# Altium project PCB_Project.PrjPcb
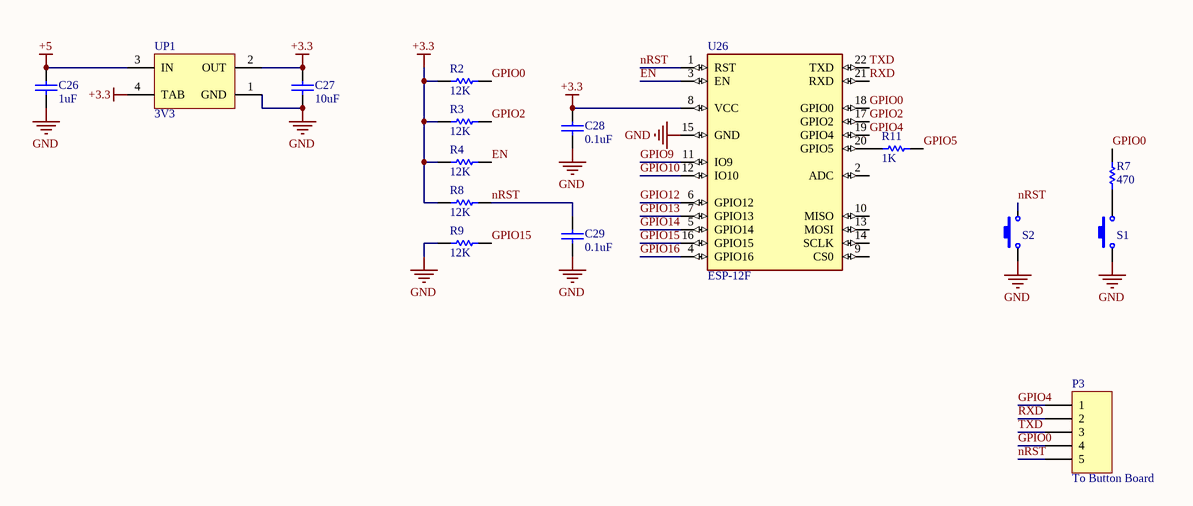
[diagram p0: Button.SchDoc]
3 sheets, 99 parts. Net scope: global (net labels, ports and power ports of the same name join across sheets).
Board files: Bottom.PcbDoc, Top.PcbDoc, LEDs.PcbDoc
Sheets:
  Button.SchDoc
  Top.SchDoc
  LEDs.SchDoc

## Sheet Button.SchDoc
size A; SheetNumber: 2; SheetTotal: 3

### Parts
C26  1uF  [CAPC3413X12N]
C27  10uF  [CAPC3413X12N]
C28  0.1uF  [CAPC3413X12N]
C29  0.1uF  [CAPC3413X12N]
P3  To Button Board  [HDR1X5]
R2  12K  [RES0805]
R3  12K  [RES0805]
R4  12K  [RES0805]
R7  470  [RES0805]
R8  12K  [RES0805]
R9  12K  [RES0805]
R11  1K  [RES0805]
S1  Switch PB  [SW-PB]  (value not drawn)
S2  Switch PB  [SW-PB]  (value not drawn)
U26  ESP-12F  [ESP-12F]
UP1  3V3  [SOT223]

### Nets
+3.3: C27.1 C28.1 R2.1 R3.1 R4.1 R8.1 U26.8(VCC) UP1.2(OUT) UP1.4(TAB)
+5: C26.1 UP1.3(IN)
GND: C26.2 C27.2 C28.2 C29.1 R9.1 S1.1 S2.1 U26.15(GND) UP1.1(GND)
EN: R4.2 U26.3(EN)
GPIO0: P3.4 R2.2 R7.1 U26.18(GPIO0)
GPIO2: R3.2 U26.17(GPIO2)
GPIO4: P3.1 U26.19(GPIO4)
GPIO5: R11.2
GPIO9: U26.11(IO9)
GPIO10: U26.12(IO10)
GPIO12: U26.6(GPIO12)
GPIO13: U26.7(GPIO13)
GPIO14: U26.5(GPIO14)
GPIO15: R9.2 U26.16(GPIO15)
GPIO16: U26.4(GPIO16)
nRST: C29.2 P3.5 R8.2 S2.2 U26.1(RST)
RXD: P3.2 U26.21(RXD)
TXD: P3.3 U26.22(TXD)
NetR7_2: R7.2 S1.2
NetR11_1: R11.1 U26.20(GPIO5)

Not connected (* = marked no-connect by the designer): U26 2(ADC) 9(CS0) 10(MISO) 13(MOSI) 14(SCLK)

### Library data of the parts
C26-C29 = CAP SMD 0805: CAP 0805; Designer: Abbas Basereh; Desc.: CAP SMD 0805; Data: 16-12-2016
P3 = Header 5: Header, 5-Pin; LatestRevisionDate: 17-Jul-2002; LatestRevisionNote: Re-released for DXP Platform.; Publisher: Altium Limited
R2-R4 R7-R9 R11 = RES SMD PACKAGE: TOTAL SMD RESISTOR PACK; Designer: Abbas Basereh; Desc.: RES SMD PAKAGES; Data: 2017-3-10
S1 S2 = Switch PB: Push Button Switch
U26 = ESP-12F: WiFi Module; MF: AI-Thinker; Price: None; SnapEDA_Link: https://www.snapeda.com/parts/ESP-12F/AI-Thinker/view-part/6648243/?ref=snap; Check_prices: https://www.snapeda.com/parts/ESP-12F/AI-Thinker/view-part/6648243/?ref=eda; Availability: No availability data; Value: *; MP: ESP-12F; Package: Package
UP1 = AMS1117-x.x: x.x Volt, 800mA Low-Dropout Linear Regulator, 4-pin SOT-223; Designer: Ali Hafizi; Data: 16-12-2016

## Sheet Top.SchDoc
size A; SheetNumber: 3; SheetTotal: 2
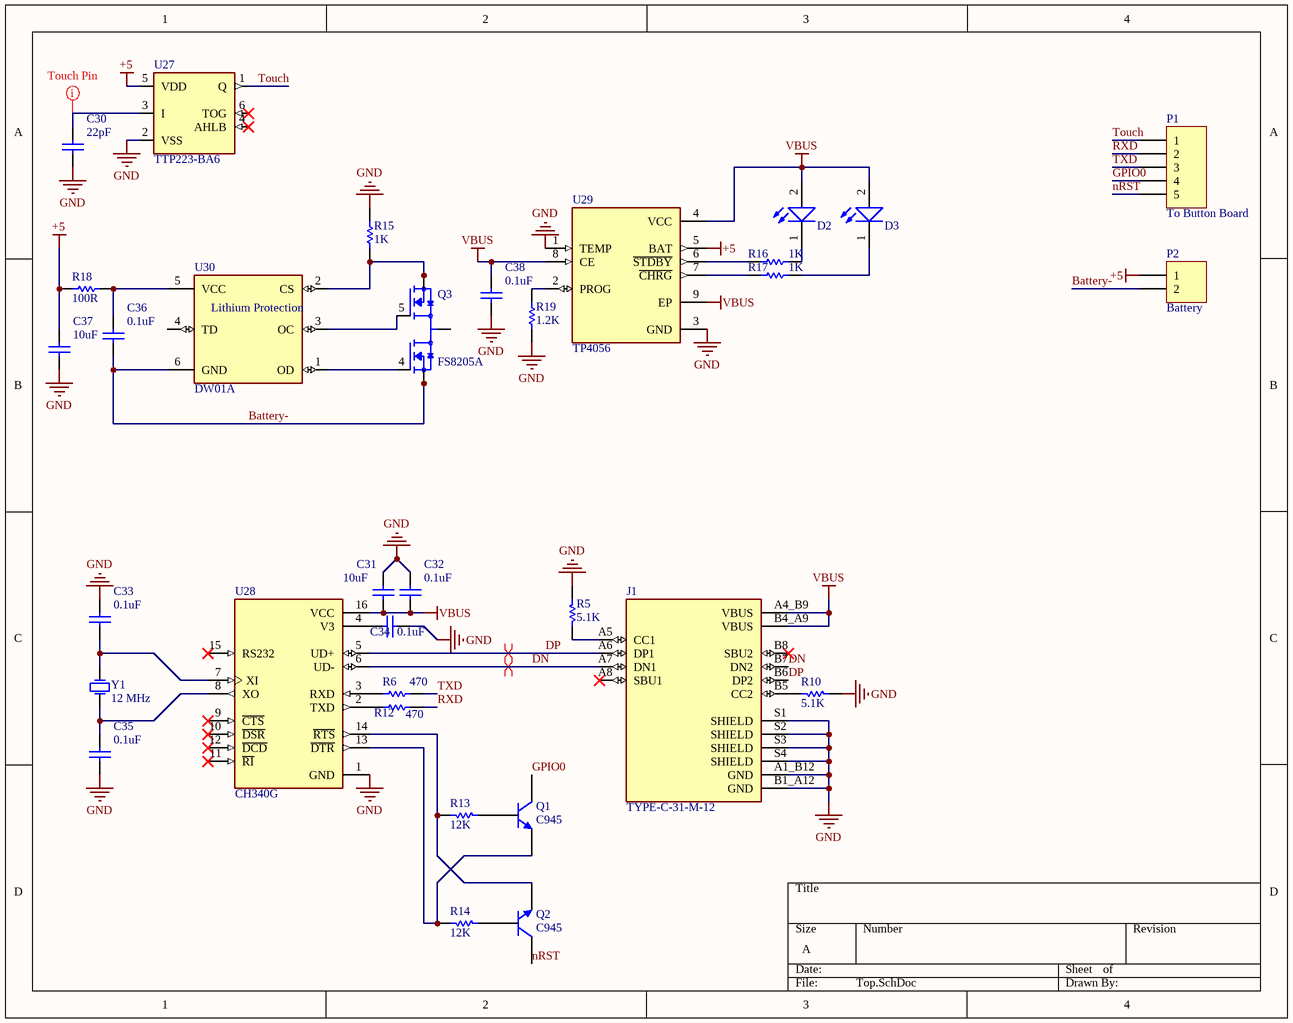
[diagram p1: Top.SchDoc]

### Parts
C30  22pF  [CAPC3413X12N]
C31  10uF  [CAPC3413X12N]
C32  0.1uF  [CAPC3413X12N]
C33  0.1uF  [CAPC3413X12N]
C34  0.1uF  [CAPC3413X12N]
C35  0.1uF  [CAPC3413X12N]
C36  0.1uF  [CAPC3413X12N]
C37  10uF  [CAPC3413X12N]
C38  0.1uF  [CAPC3413X12N]
D2  LED SMD PACKAGE  [LED_SMD_0805]  (value not drawn)
D3  LED SMD PACKAGE  [LED_SMD_0805]  (value not drawn)
J1  TYPE-C-31-M-12  [HRO_TYPE-C-31-M-12]
P1  To Button Board  [HDR1X5]
P2  Battery  [HDR1X2]
Q1  C945  [SOT23_N]
Q2  C945  [SOT23_N]
Q3  FS8205A  [SOP65P640X120-8N]
R5  5.1K  [RES0805]
R6  470  [RES0805]
R10  5.1K  [RES0805]
R12  470  [RES0805]
R13  12K  [RES0805]
R14  12K  [RES0805]
R15  1K  [RESC3413X04N]
R16  1K  [RESC3413X04N]
R17  1K  [RESC3413X04N]
R18  100R  [RESC3413X04N]
R19  1.2K  [RESC3413X04N]
U27  TTP223-BA6  [SOT23-6]
U28  CH340G  [SOIC127P600X180-16N]
U29  TP4056  [SOP127P600X175-9N]
U30  DW01A  [SOT23-6]
Y1  12 MHz  [Crystal SMD]

### Nets
+5: C37.1 P2.1 R18.1 U27.5(VDD) U29.5(BAT)
GND: C30.2 C31.1 C32.1 C33.1 C34.1 C35.2 C37.2 C38.2 J1.A1_B12(GND) J1.B1_A12(GND) J1.S1(SHIELD) J1.S2(SHIELD) J1.S3(SHIELD) J1.S4(SHIELD) R5.1 R10.1 R15.1 R19.1 U27.2(VSS) U28.1(GND) U29.1(TEMP) U29.3(GND)
VBUS: C31.2 C32.2 C38.1 D2.2(A) D3.2(A) J1.A4_B9(VBUS) J1.B4_A9(VBUS) U28.16(VCC) U29.4(VCC) U29.8(CE) U29.9(EP)
Battery-: C36.2 P2.2 Q3.2(S1) Q3.3(S1) U30.6(GND)
DN: J1.A7(DN1) J1.B7(DN2) U28.6(UD-)
DP: J1.A6(DP1) J1.B6(DP2) U28.5(UD+)
GPIO0: P1.4 Q1.3(C)
nRST: P1.5 Q2.3(C)
RXD: P1.2 R12.2
Touch: P1.1 U27.1(Q)
TXD: P1.3 R6.2
NetC30_1: C30.1 U27.3(I)
NetC33_2: C33.2 U28.7(XI) Y1.2(OSC2)
NetC34_2: C34.2 U28.4(V3)
NetC35_1: C35.1 U28.8(XO) Y1.1(OSC1)
NetC36_1: C36.1 R18.2 U30.5(VCC)
NetD2_1: D2.1(K) R16.2
NetD3_1: D3.1(K) R17.2
NetJ1_A5: J1.A5(CC1) R5.2
NetJ1_B5: J1.B5(CC2) R10.2
NetQ1_1: Q1.1(B) R13.2
NetQ1_2: Q1.2(E) R14.1 U28.13(~{DTR})
NetQ2_1: Q2.1(B) R14.2
NetQ2_2: Q2.2(E) R13.1 U28.14(~{RTS})
NetQ3_1: Q3.1(D12) Q3.8(D12)
NetQ3_4: Q3.4(G1) U30.1(OD)
NetQ3_5: Q3.5(G2) U30.3(OC)
NetQ3_6: Q3.6(S2) Q3.7(S2) R15.2 U30.2(CS)
NetR6_1: R6.1 U28.3(RXD)
NetR12_1: R12.1 U28.2(TXD)
NetR16_1: R16.1 U29.6(~{STDBY})
NetR17_1: R17.1 U29.7(~{CHRG})
NetR19_2: R19.2 U29.2(PROG)

Not connected (* = marked no-connect by the designer): J1 A8(SBU1)* B8(SBU2)*; U27 4(AHLB)* 6(TOG)*; U28 9(~{CTS})* 10(~{DSR})* 11(~{RI})* 12(~{DCD})* 15(RS232)*; U30 4(TD)

### Layout directives
differential pair: DN, DP
mark named Touch Pin: NetC30_1

### Notes on the sheet
- (in symbol DW01A) Lithium Protection

### Library data of the parts
C30-C38 = CAP SMD 0805: CAP 0805; Designer: Abbas Basereh; Desc.: CAP SMD 0805; Data: 16-12-2016
D2 D3 = LED SMD PACKAGE: SMD Mono-color Chip LED Waterclear; Part Number: 150080BS75000; Peak Wavelength: 465 nm; Forward Voltage: 3.2 V; Published Date: Jan 2017; Publisher: Ali Hafizi
J1 = TYPE-C-31-M-12: USB Connectors 24 Receptacle 1 8.94*7.3mm RoHS; MF: HRO Electronics Co., Ltd.; Price: None; Value: *; SnapEDA_Link: https://www.snapeda.com/parts/TYPE-C-31-M-12/HRO+Electronics+Co.%252C+Ltd./view-part/?ref=snap; Package: Package; Availability: Not in stock; Check_prices: https://www.snapeda.com/parts/TYPE-C-31-M-12/HRO+Electronics+Co.%252C+Ltd./view-part/?ref=eda; MP: TYPE-C-31-M-12
P1 = Header 5: Header, 5-Pin; LatestRevisionDate: 17-Jul-2002; LatestRevisionNote: Re-released for DXP Platform.; Publisher: Altium Limited
P2 = Header 2: Header, 2-Pin; LatestRevisionDate: 17-Jul-2002; LatestRevisionNote: Re-released for DXP Platform.; Publisher: Altium Limited
Q1 Q2 = C945: NPN Silicon Epitaxial Planar Transistor; Published: 2017-2-8; LatestRevisionDate: 2017; LatestRevisionNote: IPC-7351 Footprint Added.; DatasheetVersion: 2017; PackageVersion: 2017-2-8; PackageReference: SOT23; Publisher: Abbas Basereh; PackageDescription: 3-Pin SOT-23 Package 0.95 mm Pitch, 2.3 mm Lead Span; ComponentLink1Description: Manufacturer Link; ComponentLink1URL: http://www.taitroncomponents.com/; ComponentLink2Description: Datasheet; ComponentLink2URL: http://www.taitroncomponents.com/
Q3 = FS8205A: N/A; MF: Fortune Semiconductor; MP: FS8205A; Value: *; Availability: Not in stock; Package: Package; Price: None; SnapEDA_Link: https://www.snapeda.com/parts/FS8205A/Fortune+Semiconductor/view-part/?ref=snap; Check_prices: https://www.snapeda.com/parts/FS8205A/Fortune+Semiconductor/view-part/?ref=eda
R5 R6 R10 R12-R14 = RES SMD PACKAGE: as R2 on sheet Button; Data: 2017-3-10
R15-R19 = RES 0805 0.125W: RES 0805; Designer: Abbas Basereh; Desc.: RES SMD 0805; Data: 16-12-2016
U27 = TTP223-BA6: <b>DÃ©tecteur</b> de Touches Tactiles IC<p> Doc constructeur <a href="http://geii/magasin/pdf/TTP223-BA6.pdf" title="Enlarge picture"> <img src="http://geii/magasin/images/pdf.jpg"></a><p> <b>GEII/IUT ANGERS</b>; MF: tontek; Value: *; SnapEDA_Link: https://www.snapeda.com/parts/TTP223-BA6/TONTEK/view-part/?ref=snap; Price: None; Availability: Not in stock; Package: None; MP: TTP223-BA6; Check_prices: https://www.snapeda.com/parts/TTP223-BA6/TONTEK/view-part/?ref=eda
U28 = CH340G: USB Interface Integrated Circuit; MF: WCH; Value: *; SnapEDA_Link: https://www.snapeda.com/parts/Ch340G/WCH/view-part/?ref=snap; MP: Ch340G; Check_prices: https://www.snapeda.com/parts/Ch340G/WCH/view-part/?ref=eda; Availability: Not in stock; Price: None; Package: None
U29 = TP4056: Complete single cell Li-Ion battery with a constant current / constant voltage linear charger; MF: NanJing Top Power ASIC Corp.; Check_prices: https://www.snapeda.com/parts/TP4056/NanJing+Top+Power+ASIC+Corp./view-part/?ref=eda; SnapEDA_Link: https://www.snapeda.com/parts/TP4056/NanJing+Top+Power+ASIC+Corp./view-part/?ref=snap; Price: None; Availability: Not in stock; Package: Package; MP: TP4056; Value: *
U30 = DW01A: One Cell Lithium-ion/Polymer Battery Protection IC; MF: Fortune Semiconductor; SnapEDA_Link: https://www.snapeda.com/parts/DW01A/Fortune+Semiconductor/view-part/?ref=snap; Package: SOT-23-6 Fortune Semiconductor; Value: *; MP: DW01A; Check_prices: https://www.snapeda.com/parts/DW01A/Fortune+Semiconductor/view-part/?ref=eda
Y1 = XTAL: XTAL Crystal; Designer: ABBAS BASEREH; Design Date: 2017-1-3; ComponentLink1Description: Datasheet; ComponentLink2Description: Reference; Mounting Technology: Surface Mount\Through-Hole; Value: 12 MHz; Status: Unreleased

## Sheet LEDs.SchDoc
size A; SheetNumber: 1; SheetTotal: 4
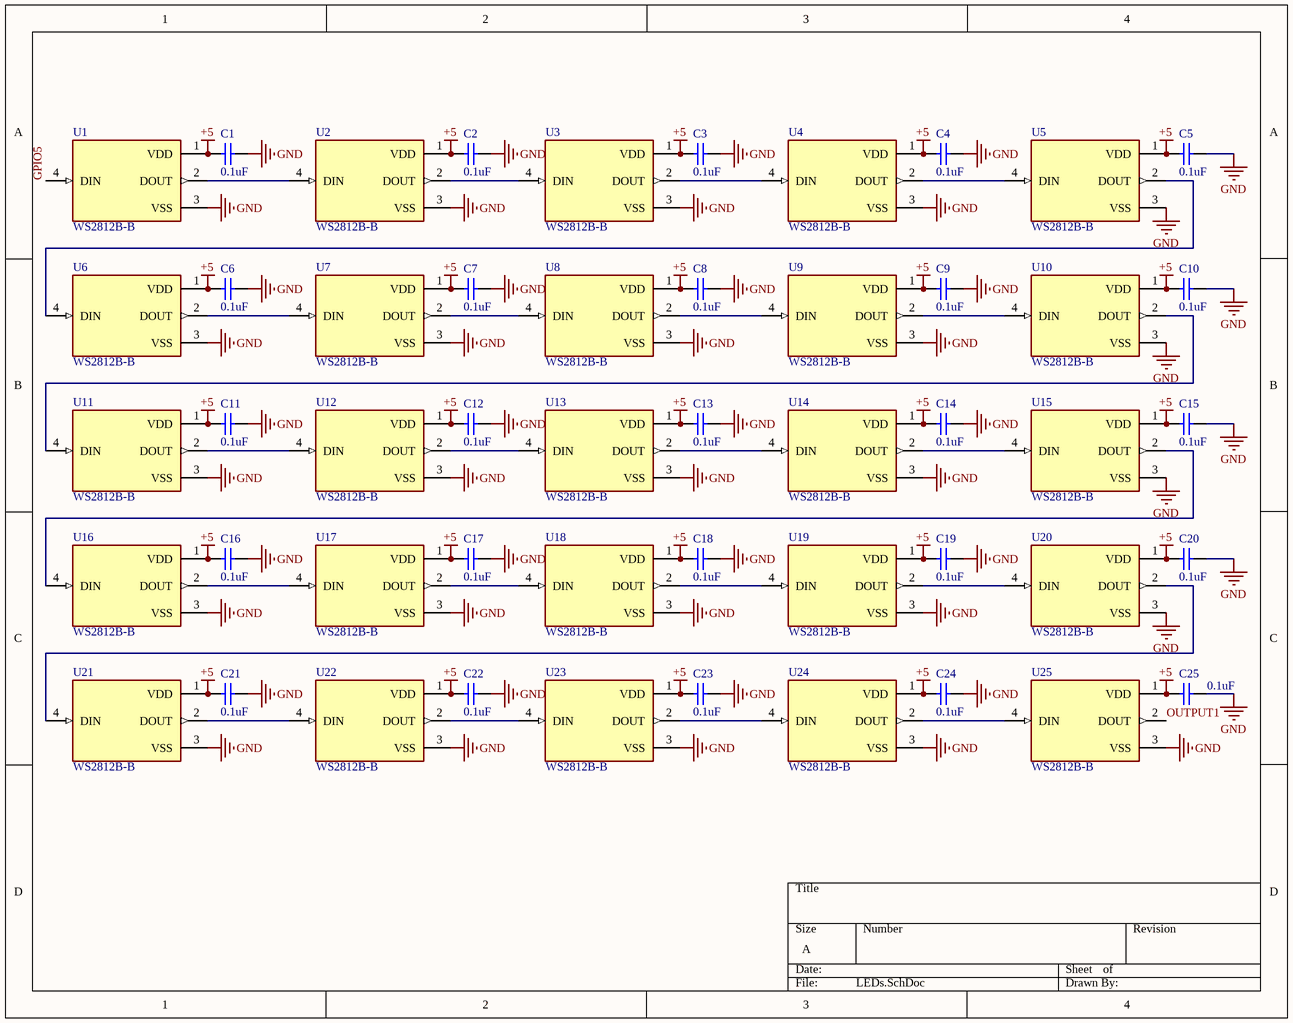
[diagram p2: LEDs.SchDoc]

### Parts
C1  0.1uF  [CAPC3413X12N]
C2  0.1uF  [CAPC3413X12N]
C3  0.1uF  [CAPC3413X12N]
C4  0.1uF  [CAPC3413X12N]
C5  0.1uF  [CAPC3413X12N]
C6  0.1uF  [CAPC3413X12N]
C7  0.1uF  [CAPC3413X12N]
C8  0.1uF  [CAPC3413X12N]
C9  0.1uF  [CAPC3413X12N]
C10  0.1uF  [CAPC3413X12N]
C11  0.1uF  [CAPC3413X12N]
C12  0.1uF  [CAPC3413X12N]
C13  0.1uF  [CAPC3413X12N]
C14  0.1uF  [CAPC3413X12N]
C15  0.1uF  [CAPC3413X12N]
C16  0.1uF  [CAPC3413X12N]
C17  0.1uF  [CAPC3413X12N]
C18  0.1uF  [CAPC3413X12N]
C19  0.1uF  [CAPC3413X12N]
C20  0.1uF  [CAPC3413X12N]
C21  0.1uF  [CAPC3413X12N]
C22  0.1uF  [CAPC3413X12N]
C23  0.1uF  [CAPC3413X12N]
C24  0.1uF  [CAPC3413X12N]
C25  0.1uF  [CAPC3413X12N]
U1  WS2812B-B  [LED_WS2812B-B]
U2  WS2812B-B  [LED_WS2812B-B]
U3  WS2812B-B  [LED_WS2812B-B]
U4  WS2812B-B  [LED_WS2812B-B]
U5  WS2812B-B  [LED_WS2812B-B]
U6  WS2812B-B  [LED_WS2812B-B]
U7  WS2812B-B  [LED_WS2812B-B]
U8  WS2812B-B  [LED_WS2812B-B]
U9  WS2812B-B  [LED_WS2812B-B]
U10  WS2812B-B  [LED_WS2812B-B]
U11  WS2812B-B  [LED_WS2812B-B]
U12  WS2812B-B  [LED_WS2812B-B]
U13  WS2812B-B  [LED_WS2812B-B]
U14  WS2812B-B  [LED_WS2812B-B]
U15  WS2812B-B  [LED_WS2812B-B]
U16  WS2812B-B  [LED_WS2812B-B]
U17  WS2812B-B  [LED_WS2812B-B]
U18  WS2812B-B  [LED_WS2812B-B]
U19  WS2812B-B  [LED_WS2812B-B]
U20  WS2812B-B  [LED_WS2812B-B]
U21  WS2812B-B  [LED_WS2812B-B]
U22  WS2812B-B  [LED_WS2812B-B]
U23  WS2812B-B  [LED_WS2812B-B]
U24  WS2812B-B  [LED_WS2812B-B]
U25  WS2812B-B  [LED_WS2812B-B]

### Nets
+5: C1.1 C2.1 C3.1 C4.1 C5.1 C6.1 C7.1 C8.1 C9.1 C10.1 C11.1 C12.1 C13.1 C14.1 C15.1 C16.1 C17.1 C18.1 C19.1 C20.1 C21.1 C22.1 C23.1 C24.1 C25.1 U1.1(VDD) U2.1(VDD) U3.1(VDD) U4.1(VDD) U5.1(VDD) U6.1(VDD) U7.1(VDD) U8.1(VDD) U9.1(VDD) U10.1(VDD) U11.1(VDD) U12.1(VDD) U13.1(VDD) U14.1(VDD) U15.1(VDD) U16.1(VDD) U17.1(VDD) U18.1(VDD) U19.1(VDD) U20.1(VDD) U21.1(VDD) U22.1(VDD) U23.1(VDD) U24.1(VDD) U25.1(VDD)
GND: C1.2 C2.2 C3.2 C4.2 C5.2 C6.2 C7.2 C8.2 C9.2 C10.2 C11.2 C12.2 C13.2 C14.2 C15.2 C16.2 C17.2 C18.2 C19.2 C20.2 C21.2 C22.2 C23.2 C24.2 C25.2 U1.3(VSS) U2.3(VSS) U3.3(VSS) U4.3(VSS) U5.3(VSS) U6.3(VSS) U7.3(VSS) U8.3(VSS) U9.3(VSS) U10.3(VSS) U11.3(VSS) U12.3(VSS) U13.3(VSS) U14.3(VSS) U15.3(VSS) U16.3(VSS) U17.3(VSS) U18.3(VSS) U19.3(VSS) U20.3(VSS) U21.3(VSS) U22.3(VSS) U23.3(VSS) U24.3(VSS) U25.3(VSS)
GPIO5: U1.4(DIN)
OUTPUT1: U25.2(DOUT)
NetU1_2: U1.2(DOUT) U2.4(DIN)
NetU2_2: U2.2(DOUT) U3.4(DIN)
NetU3_2: U3.2(DOUT) U4.4(DIN)
NetU4_2: U4.2(DOUT) U5.4(DIN)
NetU5_2: U5.2(DOUT) U6.4(DIN)
NetU6_2: U6.2(DOUT) U7.4(DIN)
NetU7_2: U7.2(DOUT) U8.4(DIN)
NetU8_2: U8.2(DOUT) U9.4(DIN)
NetU9_2: U9.2(DOUT) U10.4(DIN)
NetU10_2: U10.2(DOUT) U11.4(DIN)
NetU11_2: U11.2(DOUT) U12.4(DIN)
NetU12_2: U12.2(DOUT) U13.4(DIN)
NetU13_2: U13.2(DOUT) U14.4(DIN)
NetU14_2: U14.2(DOUT) U15.4(DIN)
NetU15_2: U15.2(DOUT) U16.4(DIN)
NetU16_2: U16.2(DOUT) U17.4(DIN)
NetU17_2: U17.2(DOUT) U18.4(DIN)
NetU18_2: U18.2(DOUT) U19.4(DIN)
NetU19_2: U19.2(DOUT) U20.4(DIN)
NetU20_2: U20.2(DOUT) U21.4(DIN)
NetU21_2: U21.2(DOUT) U22.4(DIN)
NetU22_2: U22.2(DOUT) U23.4(DIN)
NetU23_2: U23.2(DOUT) U24.4(DIN)
NetU24_2: U24.2(DOUT) U25.4(DIN)

### Library data of the parts
C1-C25 = CAP SMD 0805: CAP 0805; Designer: Abbas Basereh; Desc.: CAP SMD 0805; Data: 16-12-2016
U1-U25 = WS2812B-B: Intelligent control LED integrated light source; MF: Worldsemi; SnapEDA_Link: https://www.snapeda.com/parts/WS2812B-B/Worldsemi/view-part/5799638/?ref=snap; Package: Package; Check_prices: https://www.snapeda.com/parts/WS2812B-B/Worldsemi/view-part/5799638/?ref=eda; Availability: Unavailable; Price: None; MP: WS2812B-B; Value: *

## Nets that join several sheets
+5: Button (C26.1 UP1.3), Top (5 pins), LEDs (50 pins)
GND: Button (9 pins), Top (22 pins), LEDs (50 pins)
GPIO0: Button (P3.4 R2.2 R7.1 U26.18), Top (P1.4 Q1.3)
GPIO5: Button (R11.2), LEDs (U1.4)
nRST: Button (5 pins), Top (P1.5 Q2.3)
RXD: Button (P3.2 U26.21), Top (P1.2 R12.2)
TXD: Button (P3.3 U26.22), Top (P1.3 R6.2)